# EAGLE schematic MIDI-IO (EAGLE 6.5.0)
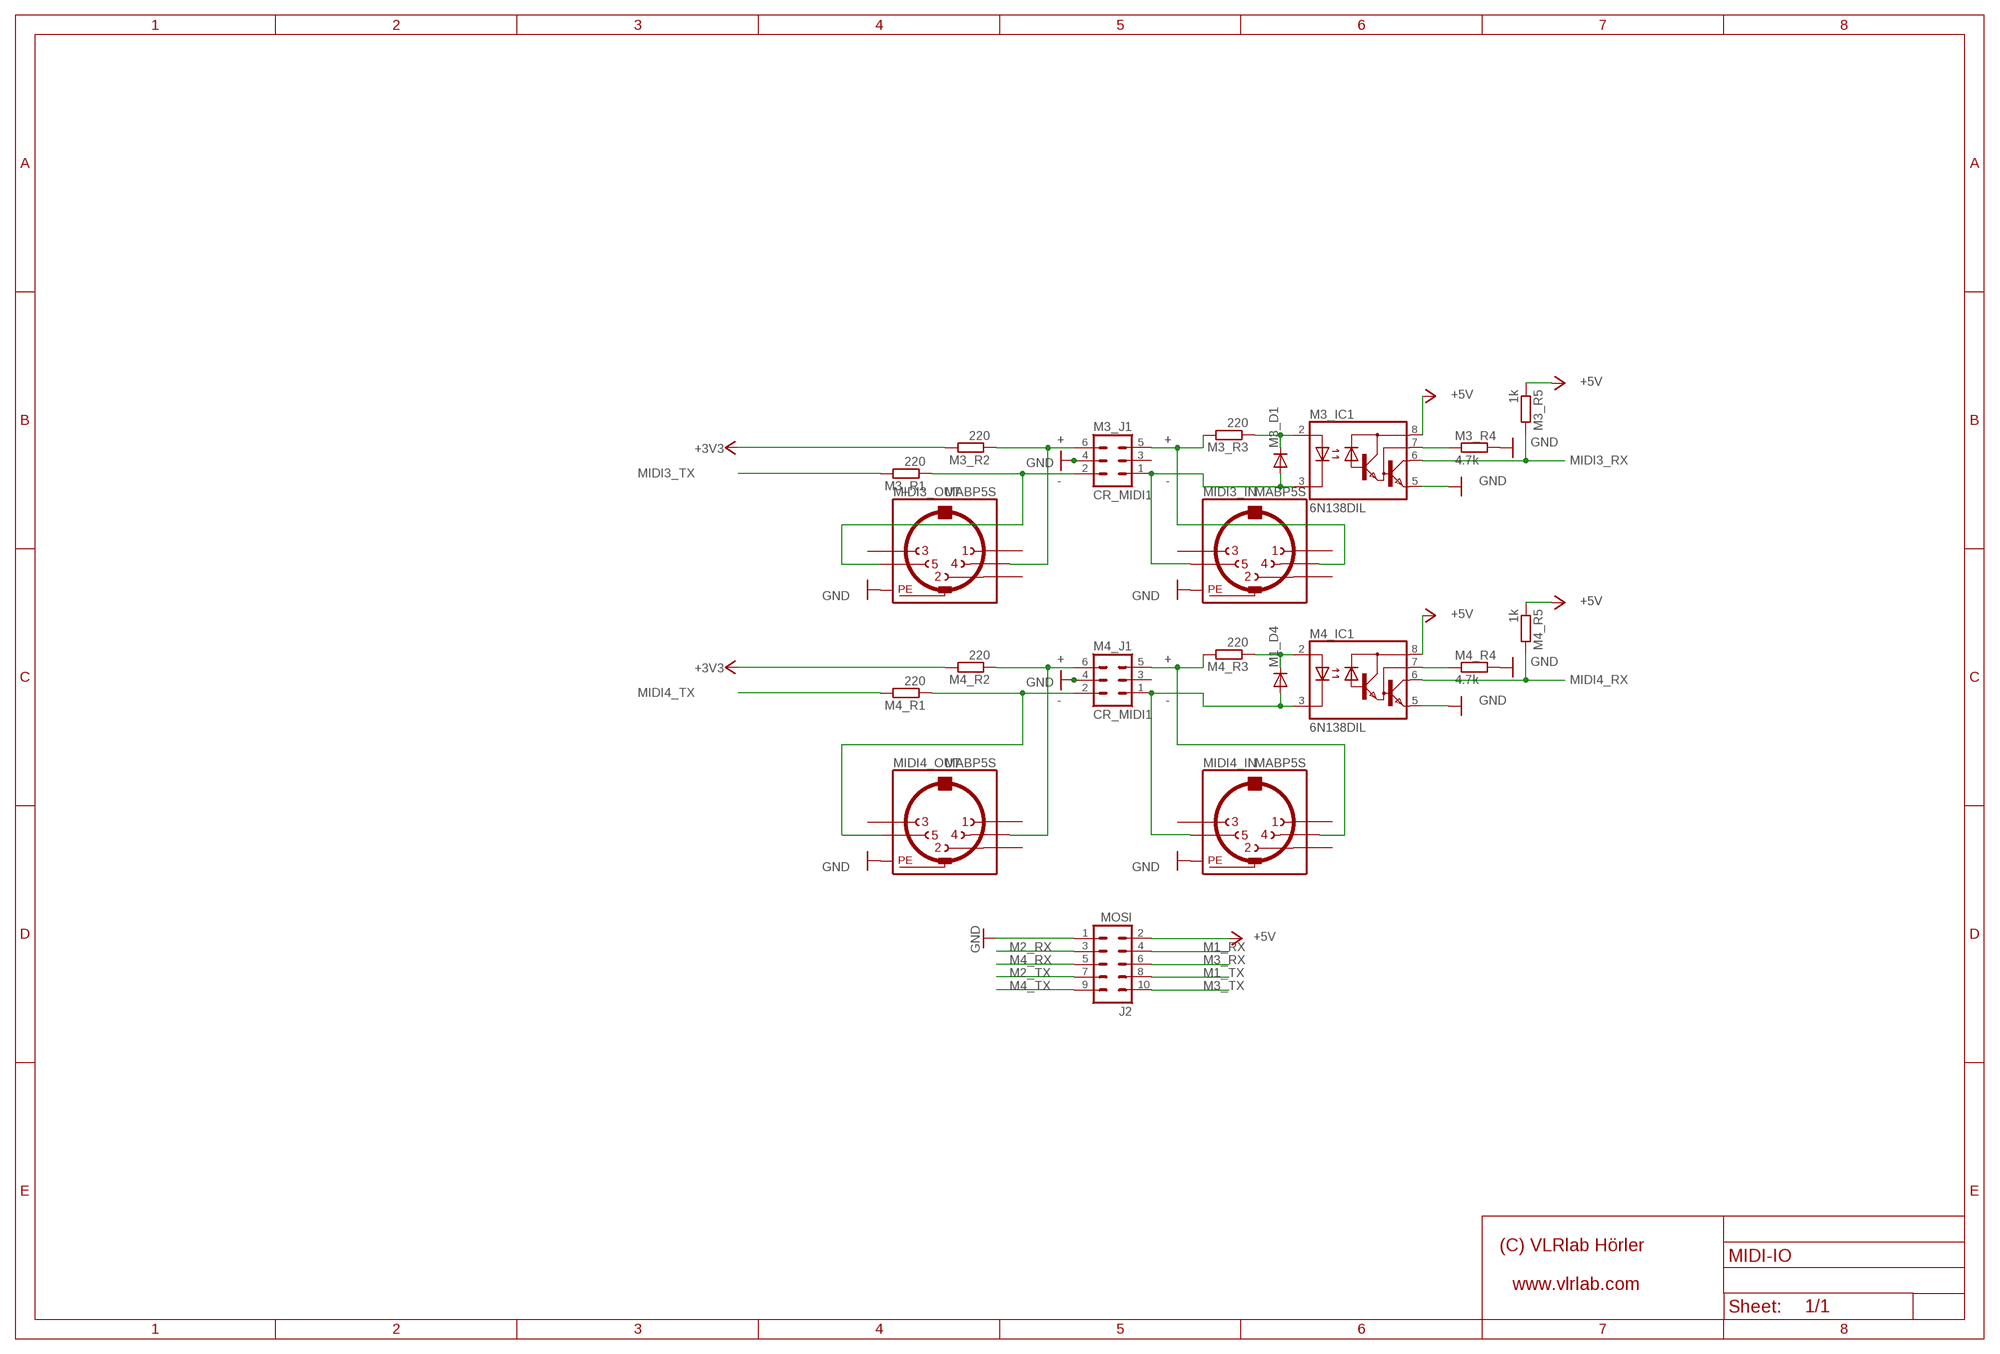
[diagram p0: schematic, sheet 1]

## Parts
J2  MOSI  ML10  [ML10]
M1_D4  1N4148DO35-7  [DO35-7]
M3_D1  1N4148DO35-7  [DO35-7]
M3_IC1  6N138DIL  [DIL08]
M3_J1  CR_MIDI1  ML6  [ML6]
M3_R1  220  R-EU_0204/7  [0204/7]
M3_R2  220  R-EU_0204/7  [0204/7]
M3_R3  220  R-EU_0204/7  [0204/7]
M3_R4  4.7k  R-EU_0204/7  [0204/7]
M3_R5  1k  R-EU_0204/7  [0204/7]
M4_IC1  6N138DIL  [DIL08]
M4_J1  CR_MIDI1  ML6  [ML6]
M4_R1  220  R-EU_0204/7  [0204/7]
M4_R2  220  R-EU_0204/7  [0204/7]
M4_R3  220  R-EU_0204/7  [0204/7]
M4_R4  4.7k  R-EU_0204/7  [0204/7]
M4_R5  1k  R-EU_0204/7  [0204/7]
MIDI3_IN  MABP5S  [MABP5S]
MIDI3_OUT  MABP5S  [MABP5S]
MIDI4_IN  MABP5S  [MABP5S]
MIDI4_OUT  MABP5S  [MABP5S]

## Nets
+3V3 [SDcard]: M3_R2.2 M4_R2.2
+5V [VDD]: J2.2 M3_IC1.8(VCC) M3_R5.1 M4_IC1.8(VCC) M4_R5.1
GND: J2.1 M3_IC1.5(GND) M3_J1.4 M3_R4.2 M4_IC1.5(GND) M4_J1.4 M4_R4.2 MIDI3_IN.PE MIDI3_IN.PE@(PE) MIDI3_OUT.PE MIDI3_OUT.PE@(PE) MIDI4_IN.PE MIDI4_IN.PE@(PE) MIDI4_OUT.PE MIDI4_OUT.PE@(PE)
M1_RX: J2.4
M1_TX: J2.8
M2_RX: J2.3
M2_TX: J2.7
M3_R4: M3_IC1.7(VB) M3_R4.1
M3_RX: J2.6
M3_RX+: M3_J1.5 M3_R3.2 MIDI3_IN.4
M3_RX+D1: M3_D1.C M3_IC1.2(A) M3_R3.1
M3_RX-: M3_D1.A M3_IC1.3(C) M3_J1.1 MIDI3_IN.5
M3_TX: J2.10
M3_TX+: M3_J1.6 M3_R2.1 MIDI3_OUT.4
M3_TX-: M3_J1.2 M3_R1.1 MIDI3_OUT.5
M4_R4: M4_IC1.7(VB) M4_R4.1
M4_RX: J2.5
M4_RX+: M4_J1.5 M4_R3.2 MIDI4_IN.4
M4_RX+D1: M1_D4.C M4_IC1.2(A) M4_R3.1
M4_RX-: M1_D4.A M4_IC1.3(C) M4_J1.1 MIDI4_IN.5
M4_TX: J2.9
M4_TX+: M4_J1.6 M4_R2.1 MIDI4_OUT.4
M4_TX-: M4_J1.2 M4_R1.1 MIDI4_OUT.5
MIDI3_RX: M3_IC1.6(VO) M3_R5.2
MIDI3_TX: M3_R1.2
MIDI4_RX: M4_IC1.6(VO) M4_R5.2
MIDI4_TX: M4_R1.2
N$22: M3_J1.3
N$27: M4_J1.3
Unconnected: MIDI3_IN.1 MIDI3_IN.2 MIDI3_IN.3 MIDI3_OUT.1 MIDI3_OUT.2 MIDI3_OUT.3 MIDI4_IN.1 MIDI4_IN.2 MIDI4_IN.3 MIDI4_OUT.1 MIDI4_OUT.2 MIDI4_OUT.3

## Notes on the sheet
- + | +
- - | -
- + | +
- - | -

## Library data of the parts
J2 = con-harting-ml:ML10: HARTING; OC_FARNELL: unknown; OC_NEWARK: unknown
M1_D4 M3_D1 = diode:1N4148: DIODE high speed (Philips)
M3_IC1 M4_IC1 = 6N138:6N138DIL
M3_J1 M4_J1 = con-harting-ml:ML6: HARTING; OC_FARNELL: unknown; OC_NEWARK: unknown
M3_R1-M3_R5 M4_R1-M4_R5 = resistor:R-EU_: RESISTOR, European symbol
MIDI3_IN MIDI3_OUT MIDI4_IN MIDI4_OUT = midi:MABP5S

## Net classes
0 default: width 0.254 mm, drill 0.33 mm, clearance 0.254 mm
1 VDD: width 1.016 mm, drill 0.33 mm, clearance 0.254 mm to class 0, clearance 0.254 mm
3 SDcard: width 0.406 mm